# EAGLE schematic wiseboard (EAGLE 8.2.2)
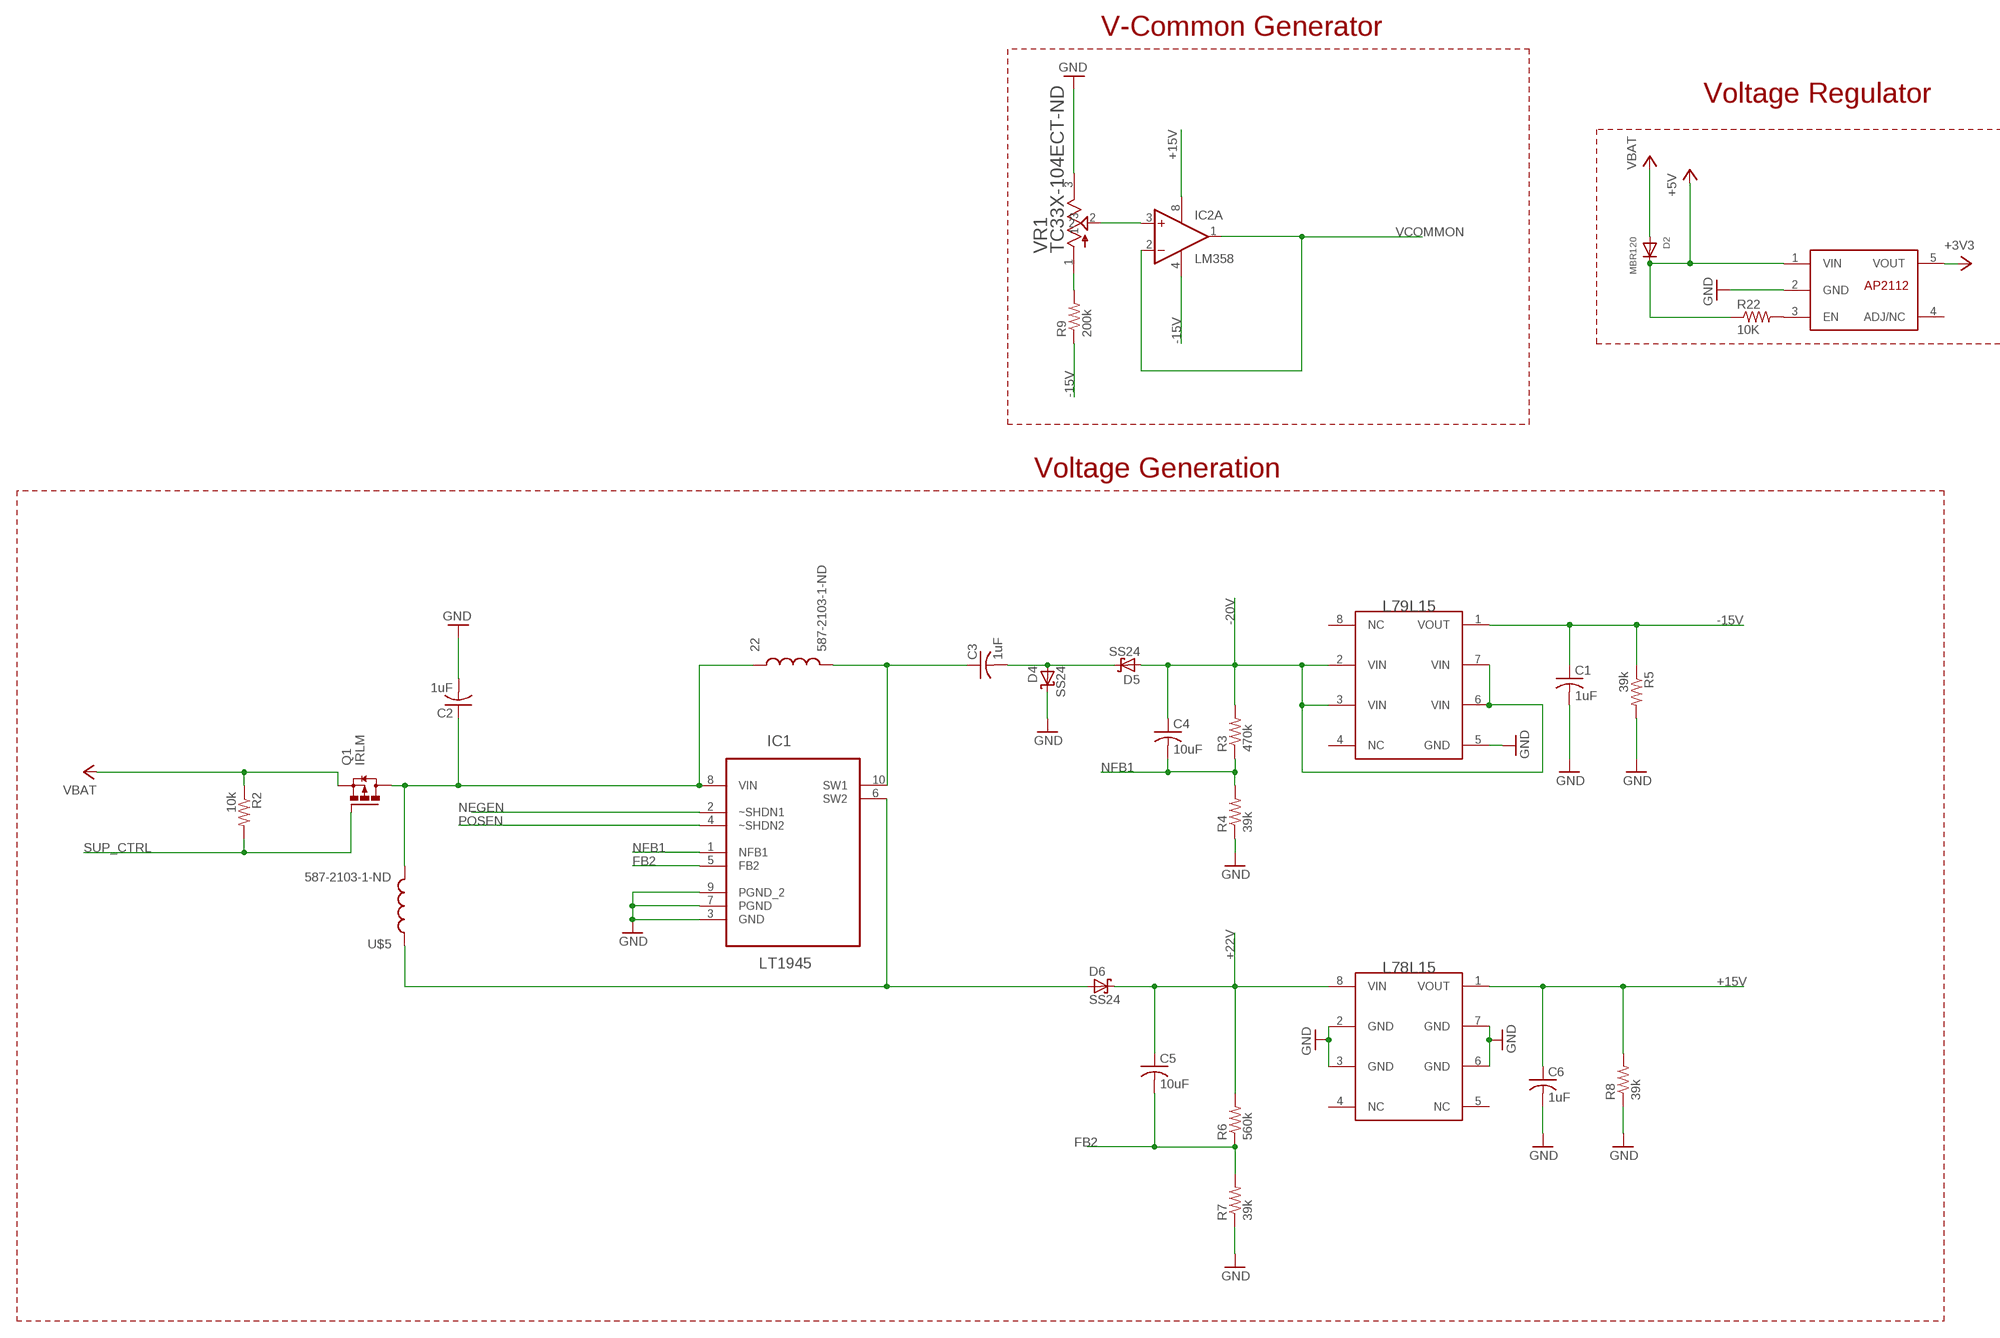
[diagram p0: schematic, sheet 1, part 1 of 2]
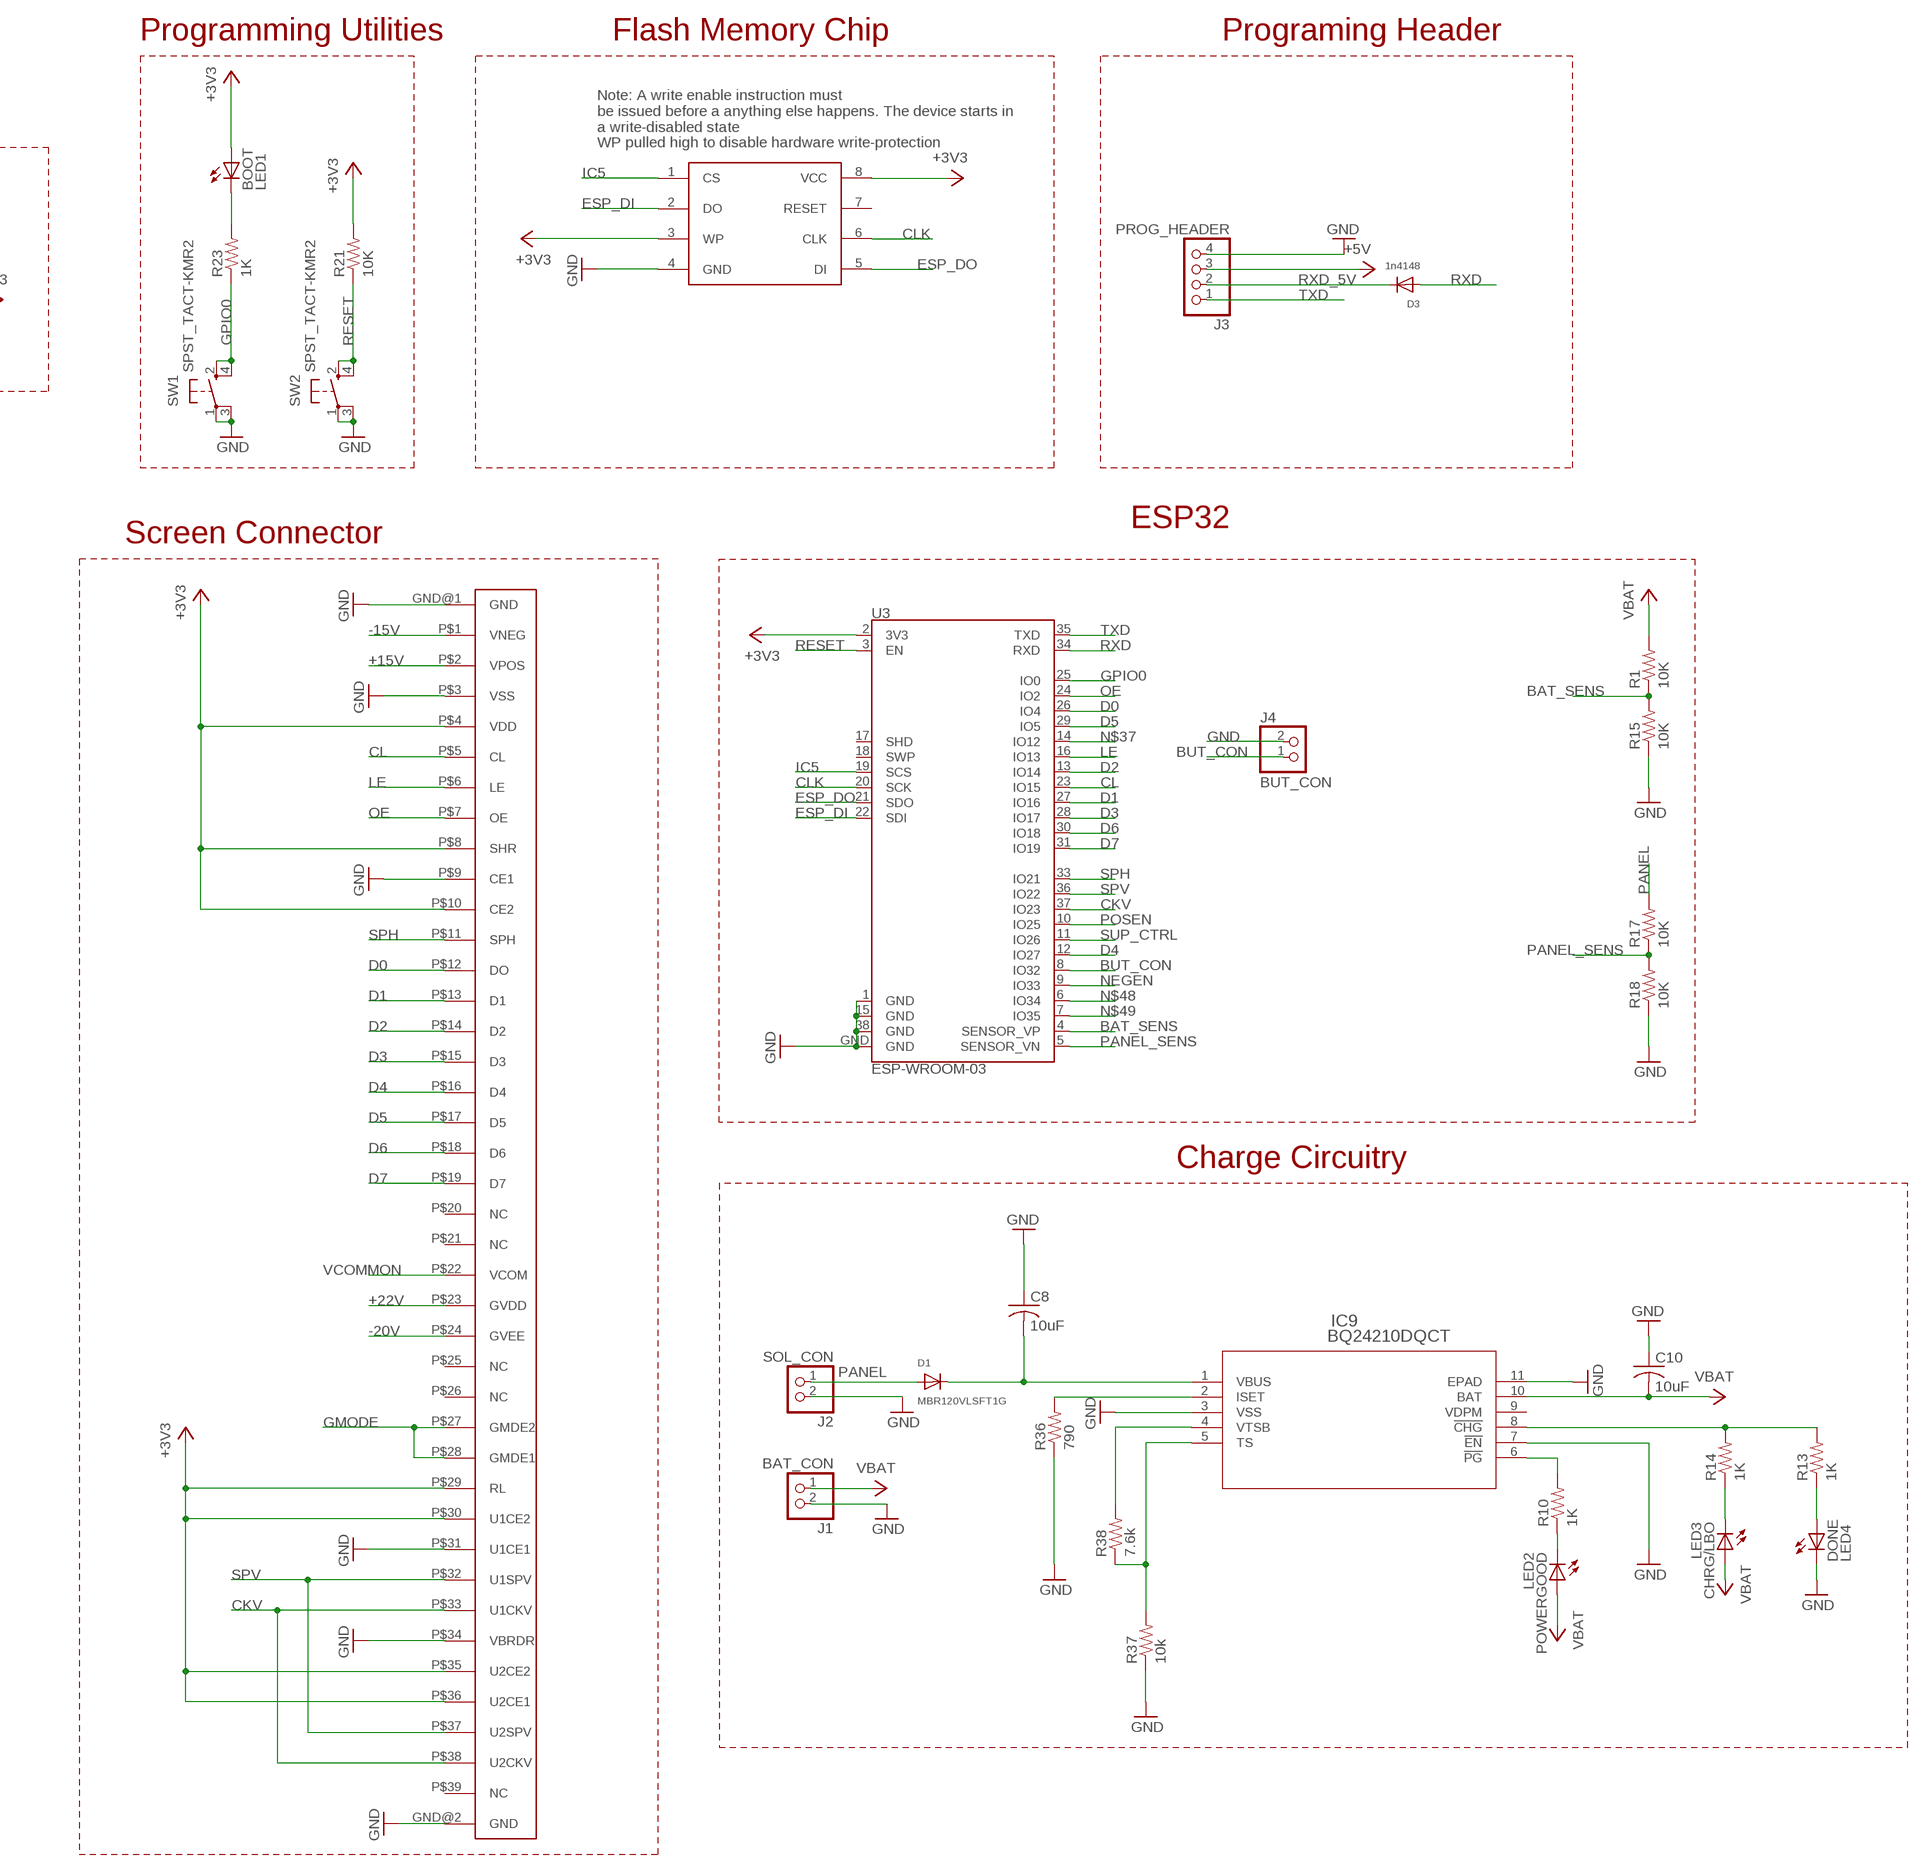
[diagram p1: schematic, sheet 1, part 2 of 2]

## Parts
22  587-2103-1-ND  [587-2103-1-ND]
BOOT  LED1  LEDCHIP-LED0805  [CHIP-LED0805]
C1  1uF  C-USC0805  [C0805]
C2  1uF  C-USC0805  [C0805]
C3  1uF  C-USC0805  [C0805]
C4  10uF  C-USC0805  [C0805]
C5  10uF  C-USC0805  [C0805]
C6  1uF  C-USC0805  [C0805]
C8  10uF  C-USC0805  [C0805]
C10  10uF  C-USC0805  [C0805]
CHRG/LBO  LED3  LEDCHIP-LED0805  [CHIP-LED0805]
D1  MBR120VLSFT1G  DIODESOD-123  [SOD-123]
D2  MBR120  DIODESOD-123  [SOD-123]
D3  1n4148  DIODESOD-123  [SOD-123]
D4  SS24  [DO214AA]
D5  SS24  [DO214AA]
D6  SS24  [DO214AA]
DONE  LED4  LEDCHIP-LED0805  [CHIP-LED0805]
IC1  LT1945  LT1945EMSPBF  [SOP50P490X110-10N]
IC2  LM358  LM358MX  [SO08]
IC3  L79L15  [SO8]
IC4  L78L15  [SO8]
IC5  W25Q  W25Q32JVSSIQ  [SO8]
IC8  IC6  AP2112  [SOT95P280X145-5N]
IC9  BQ24210DQCT  [DQC10_P84X2P4]
J1  BAT_CON  EDGE_CON_22PIN  [EDGE_CON_2]
J2  SOL_CON  EDGE_CON_22PIN  [EDGE_CON_2]
J3  PROG_HEADER  EDGE_CON_4  [EDGE_CON_4]
J4  BUT_CON  EDGE_CON_22PIN  [EDGE_CON_2]
POWERGOOD  LED2  LEDCHIP-LED0805  [CHIP-LED0805]
Q1  IRLM  IRLML6402TRPBF  [SOT23]
R1  10K  R-US_R0805  [R0805]
R2  10k  R-US_R0805  [R0805]
R3  470k  R-US_R0805  [R0805]
R4  39k  R-US_R0805  [R0805]
R5  39k  R-US_R0805  [R0805]
R6  560k  R-US_R0805  [R0805]
R7  39k  R-US_R0805  [R0805]
R8  39k  R-US_R0805  [R0805]
R9  200k  R-US_R0805  [R0805]
R10  1K  R-US_R0805  [R0805]
R13  1K  R-US_R0805  [R0805]
R14  1K  R-US_R0805  [R0805]
R15  10K  R-US_R0805  [R0805]
R17  10K  R-US_R0805  [R0805]
R18  10K  R-US_R0805  [R0805]
R21  10K  R-US_R0805  [R0805]
R22  10K  R-US_R0805  [R0805]
R23  1K  R-US_R0805  [R0805]
R36  790  R-US_R0805  [R0805]
R37  10k  R-US_R0805  [R0805]
R38  7.6k  R-US_R0805  [R0805]
SW1  SPST_TACT-KMR2  [KMR2]
SW2  SPST_TACT-KMR2  [KMR2]
U3  ESP-WROOM-03  [ESP-WROOM-03]
U$4  FH26W-39S  [HFQ339CT-ND]
U$5  587-2103-1-ND  [587-2103-1-ND]
VR1  TC33X-104ECT-ND  TC33X-2-103E  [TRIM_TC33X-2-103E]

## Nets
+3V3: BOOT.A IC5.3(WP) IC5.8(VCC) IC8.5(VOUT) R21.2 U3.2(3V3) U$4.P$4(VDD) U$4.P$8(SHR) U$4.P$10(CE2) U$4.P$29(RL) U$4.P$30(U1CE2) U$4.P$35(U2CE2) U$4.P$36(U2CE1)
+5V: D2.C IC8.1(VIN) J3.3 R22.1
+15V: C6.1 IC4.1(VOUT) R8.2 U$4.P$2(VPOS)
+22V: C5.1 D6.C IC4.8(VIN) R6.2 U$4.P$23(GVDD)
-15V: C1.1 IC3.1(VOUT) R5.1 R9.1 U$4.P$1(VNEG)
-20V: C4.1 D5.A IC3.2(VIN) IC3.3(VIN) IC3.6(VIN) IC3.7(VIN) R3.2 U$4.P$24(GVEE)
BAT_SENS: R1.1 R15.2 U3.4(SENSOR_VP)
BUT_CON: J4.1 U3.8(IO32)
CKV: U3.37(IO23) U$4.P$33(U1CKV) U$4.P$38(U2CKV)
CL: U3.23(IO15) U$4.P$5(CL)
CLK: IC5.6(CLK) U3.20(SCK)
D0: U3.26(IO4) U$4.P$12(DO)
D1: U3.27(IO16) U$4.P$13(D1)
D2: U3.13(IO14) U$4.P$14(D2)
D3: U3.28(IO17) U$4.P$15(D3)
D4: U3.12(IO27) U$4.P$16(D4)
D5: U3.29(IO5) U$4.P$17(D5)
D6: U3.30(IO18) U$4.P$18(D6)
D7: U3.31(IO19) U$4.P$19(D7)
ESP_DI: IC5.2(DO) U3.22(SDI)
ESP_DO: IC5.5(DI) U3.21(SDO)
FB2: C5.2 IC1.5(FB2) R6.1 R7.2
GMODE: U$4.P$27(GMDE2) U$4.P$28(GMDE1)
GND: C1.2 C2.2 C6.2 C8.1 C10.1 D4.C DONE.C IC1.3(GND) IC1.7(PGND) IC1.9(PGND_2) IC3.5(GND) IC4.2(GND) IC4.3(GND) IC4.6(GND) IC4.7(GND) IC5.4(GND) IC8.2(GND) IC9.3(VSS) IC9.7(!EN) IC9.11(EPAD) J1.2 J2.2 J3.4 J4.2 R4.1 R5.2 R7.1 R8.1 R15.1 R18.1 R36.1 R37.1 SW1.1(P) SW1.3(P1) SW2.1(P) SW2.3(P1) U3.1(GND) U3.15(GND) U3.38(GND) U3.GND U$4.GND@1(GND) U$4.GND@2(GND) U$4.P$3(VSS) U$4.P$9(CE1) U$4.P$31(U1CE1) U$4.P$34(VBRDR) VR1.3
GPIO0: R23.1 SW1.2(S) SW1.4(S1) U3.25(IO0)
IC5: IC5.1(CS) U3.19(SCS)
LE: U3.16(IO13) U$4.P$6(LE)
N$1: IC2.3(A:+IN) VR1.2
N$2: 22.P$2 C3.1 IC1.10(SW1)
N$3: C8.2 D1.C IC9.1(VBUS)
N$4: 22.P$1 C2.1 IC1.8(VIN) Q1.3(D) U$5.P$2
N$5: D6.A IC1.6(SW2) U$5.P$1
N$6: C3.2 D4.A D5.C
N$8: R9.2 VR1.1
N$9: IC9.6(!PG) R10.2
N$10: CHRG/LBO.C R14.1
N$11: POWERGOOD.C R10.1
N$14: DONE.A R13.1
N$15: IC9.8(!CHG) R13.2 R14.2
N$17: IC9.2(ISET) R36.2
N$22: BOOT.C R23.2
N$23: IC8.3(EN) R22.2
N$28: IC9.5(TS) R37.2 R38.1
N$30: IC9.4(VTSB) R38.2
N$37: U3.14(IO12)
N$48: U3.6(IO34)
N$49: U3.7(IO35)
NEGEN: IC1.2(~SHDN1) U3.9(IO33)
NFB1: C4.2 IC1.1(NFB1) R3.1 R4.2
OE: U3.24(IO2) U$4.P$7(OE)
PANEL: D1.A J2.1 R17.2
PANEL_SENS: R17.1 R18.2 U3.5(SENSOR_VN)
POSEN: IC1.4(~SHDN2) U3.10(IO25)
RESET: R21.1 SW2.2(S) SW2.4(S1) U3.3(EN)
RXD: D3.A U3.34(RXD)
RXD_5V: D3.C J3.2
SPH: U3.33(IO21) U$4.P$11(SPH)
SPV: U3.36(IO22) U$4.P$32(U1SPV) U$4.P$37(U2SPV)
SUP_CTRL: Q1.1(G) R2.2 U3.11(IO26)
TXD: J3.1 U3.35(TXD)
VBAT: C10.2 CHRG/LBO.A D2.A IC9.10(BAT) J1.1 POWERGOOD.A Q1.2(S) R1.2 R2.1
VCOMMON: IC2.1(A:OUT) IC2.2(A:-IN) U$4.P$22(VCOM)
Unconnected: IC2.5(B:+IN) IC2.6(B:-IN) IC2.7(B:OUT) IC3.4(NC) IC3.8(NC) IC4.4(NC) IC4.5(NC) IC5.7(RESET) IC8.4(ADJ/NC) IC9.9(VDPM) U3.17(SHD) U3.18(SWP) U$4.P$20(NC) U$4.P$21(NC) U$4.P$25(NC) U$4.P$26(NC) U$4.P$39(NC)

## Notes on the sheet
- V-Common Generator | Programming Utilities | Flash Memory Chip | Programing Header
- Voltage Regulator
- Note: A write enable instruction must
  be issued before a anything else happens. The device starts in 
  a write-disabled state
- WP pulled high to disable hardware write-protection
- ESP32
- Voltage Generation | Screen Connector
- Charge Circuitry

## Power pins joined to a net without a drawn wire
V+: IC2.8(P:V+)
V-: IC2.4(P:V-)

## Library data of the parts
22 U$5 = WISE:587-2103-1-ND
BOOT CHRG/LBO DONE POWERGOOD = adafruit:LED: LED OSRAM: - CHIPLED LG R971, LG N971, LY N971, LG Q971, LY Q971, LO R971, LY R971 LH N974, LH R974 LS Q976, LO Q976, LY Q976 LO Q996 - Hyper CHIPLED LW Q18S LB Q993, LB Q99A, LB R99A - SideLED LS A670, LO A670, LY A670, LG A670, LP A670 LB A673, LV A673, LT A673, LW A673 LH A674 LY A675 LS A676, LA A676, LO A676, LY A676, LW A676 LS A679, LY A679, LG A679 - Hyper Micro SIDELED® LS Y876, LA Y876, LO Y876, LY Y876 LT Y87S - SmartLED LW L88C, LW L88S LB L89C, LB L89S, LG L890 LS L89K, LO L89K, LY L89K LS L896, LA L896, LO L896, LY L896 - TOPLED LS T670, LO T670, LY T670, LG T670, LP T670 LSG T670, LSP T670, LSY T670, LOP T670, LYG T670 LG T671, LOG T671, LSG T671 LB T673, LV T673, LT T673, LW T673 LH T674 LS T676, LA T676, LO T676, LY T676, LB T676, LH T676, LSB T676, LW T676 LB T67C, LV T67C, LT T67C, LS T67K, LO T67K, LY T67K, LW E67C LS E67B, LA E67B, LO E67B, LY E67B, LB E67C, LV E67C, LT E67C LW T67C LS T679, LY T679, LG T679 LS T770, LO T770, LY T770, LG T770, LP T770 LB T773, LV T773, LT T773, LW T773 LH T774 LS E675, LA E675, LY E675, LS T675 LS T776, LA T776, LO T776, LY T776, LB T776 LHGB T686 LT T68C, LB T68C - Hyper Mini TOPLED® LB M676 - Mini TOPLED Santana® LG M470 LS M47K, LO M47K, LY M47K Source: http://www.osram.convergy.de/
C1-C6 C8 C10 = resistor:C-US: CAPACITOR, American symbol
D1 = microbuilder:DIODE: Diode
D2 D3 = adafruit:DIODE: Diode
D4-D6 = WISE:SS24
IC1 = LTC_By_element14_Batch_1:LT1945EMSPBF: Dual Micropower DC/DC Converter with Positive and Converter with Positive and; MPN: LT1945EMS#PBF; OC_FARNELL: 1273495; OC_NEWARK: 57M7266; PACKAGE: MSOP-10; SUPPLIER: Linear Technology
IC2 = linear:LM358: OP AMP also LM158; LM258; LM2904 Source: http://cache.national.com/ds/LM/LM158.pdf
IC3 = WISE:L79L15
IC4 = WISE:L78L15
IC5 = WISE:W25Q32JVSSIQ
IC8 = WISE:AP2112
IC9 = WISE:BQ24210DQCT; MANUFACTURER_PART_NUMBER: BQ24210DQCT; VENDOR: Vendor
J1 J2 J4 = WISE:EDGE_CON_2
J3 = WISE:EDGE_CON_4
Q1 = IRLML6402:IRLML6402: HEXFET P-Channel Power MOSFET; AVAILABILITY: Unavailable; DESCRIPTION: MOSFETs, Semiconductors and Actives, mosfet, Transistors, Discretes (diodes, transistors, thyristors ...); MF: International Rectifier; MP: IRLML6402; PACKAGE: SOT-23-3 International Rectifier; PRICE: None
R1-R10 R13-R15 R17 R18 R21-R23 R36-R38 = resistor:R-US_: RESISTOR, American symbol
SW1 SW2 = adafruit:SPST_TACT: SMT 6mm switch, EVQQ2 series http://www.ladyada.net/library/eagle
U3 = esp32:ESP-WROOM-03
U$4 = WISE:FH26W-39S
VR1 = WISE:TC33X-2-103E: Res Cermet POT 10K Ohm 25% 0.1W(1/10W) 1(Elec)/1(Mech)Turn 3mm (3 X 3.65 X 1.85mm) Foot Print SMD T/R; AVAILABILITY: Good; DESCRIPTION: Res%20Trimmer%2010K%20Ohm%2025%25%200.1W%281/10W%29%201%28Elec%29/1%28Mech%29Turn%20%283%20X%203.8mm%29%20Foot%20Print%20SMD%20Embossed%20T/R; MF: Bourns; MP: TC33X-2-103E; PACKAGE: None; PRICE: 0.16 USD